# Altium schematic sheet 02_Power.SchDoc: OpenCamera Slider - Power
size A4; SheetNumber: 2; SheetTotal: 4; sk_ProjectName: WInFiDEL Sensor; sk_Title: Power and USB Connector
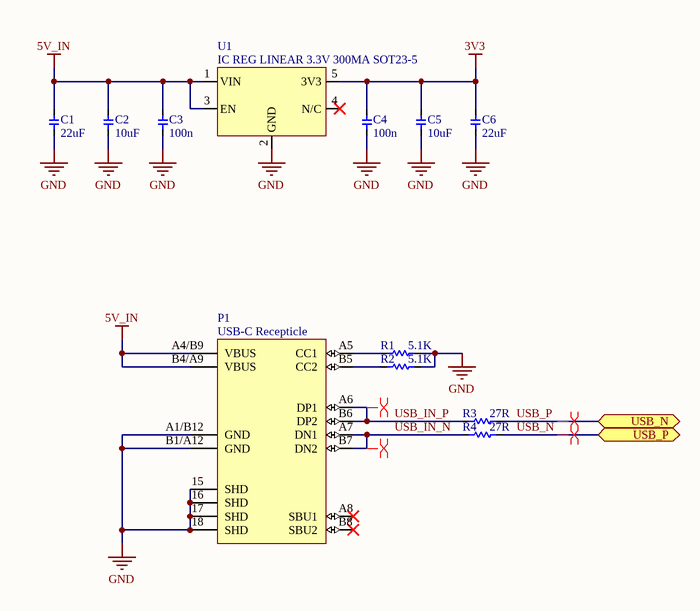
[diagram p0: 02_Power.SchDoc]

## Parts
C1  value 22uF  [0805]  (hidden comment: Cap)
C2  value 10uF  [0603 - CAP]  (hidden comment: Cap)
C3  value 100n  [0603 - CAP]  (hidden comment: Cap)
C4  value 100n  [0603 - CAP]  (hidden comment: Cap)
C5  value 10uF  [0603 - CAP]  (hidden comment: Cap)
C6  value 22uF  [0805]  (hidden comment: Cap)
P1  USB-C Recepticle  [GCT_USB4105-GF-A]
R1  value 5.1K  [0603]  (hidden comment: Res)
R2  value 5.1K  [0603]  (hidden comment: Res)
R3  value 27R  [0603]  (hidden comment: Res)
R4  value 27R  [0603]  (hidden comment: Res)
U1  IC REG LINEAR 3.3V 300MA SOT23-5  [SOT-23-5]

## Ports
USB_N (bidir), USB_P (bidir)

## Nets
3V3: C4.2 C5.2 C6.2 U1.5(3V3)
5V_IN: C1.2 C2.2 C3.2 P1.A4/B9(VBUS) P1.B4/A9(VBUS) U1.1(VIN) U1.3(EN)
GND: C1.1 C2.1 C3.1 C4.1 C5.1 C6.1 P1.15(SHD) P1.16(SHD) P1.17(SHD) P1.18(SHD) P1.A1/B12(GND) P1.B1/A12(GND) R1.2 R2.2 U1.2(GND)
USB_IN_N: P1.A7(DN1) P1.B7(DN2) R4.1
USB_IN_P: P1.A6(DP1) P1.B6(DP2) R3.1
USB_N: R4.2 ; port USB_P
USB_P: R3.2 ; port USB_N
NetP1_A5: P1.A5(CC1) R1.1
NetP1_B5: P1.B5(CC2) R2.1

Not connected (* = marked no-connect by the designer): P1 A8(SBU1)* B8(SBU2)*; U1 4(N/C)*

## Layout directives
differential pair: USB_IN_N, USB_IN_P, USB_N, USB_P

## Notes on the sheet
- Page
- Title
- www.SasaKaranovic.com <http://www.SasaKaranovic.com>
- of

## Library data of the parts
C1 C6 = Cap: Capacitor; Manufacturer: Samsung Electro-Mechanics; Manufacturer Part Number: CL21A226MAYNNNE; Voltage: 25V; Distributor Part Number: C602037; Distributor: LCSC
C2 C5 = Cap: Capacitor; Manufacturer: Samsung Electro-Mechanics; Manufacturer Part Number: CL21A106KAYNNNE; Voltage: 25V; Distributor Part Number: C15850; Distributor: LCSC
C3 C4 = Cap: Capacitor; Manufacturer: Samsung Electro-Mechanics; Manufacturer Part Number: CL10B104KB8NNNC; Voltage: 50V; Temp Rating: X7R; Distributor Part Number: C1591; Distributor: LCSC
P1 = USB-C Recepticle -USB-TYPE-C-019: 3A 1 Surface Mount 16P Female -25℃~+85℃ Type-C SMD USB Connectors ROHS; Manufacturer: DEALON; Manufacturer Part Number: USB-TYPE-C-019; Distributor Part Number: C2927039; Distributor: LCSC
R1 R2 = Res: Resistor; Manufacturer: YAGEO; Manufacturer Part Number: RC0603FR-075K1L; Power Rating: 100mW; Tolerance: 1%; Distributor: LCSC; Distributor Part Number: C105580
R3 R4 = Res: Resistor; Manufacturer: YAGEO; Manufacturer Part Number: RC0603FR-0727RL; Power Rating: 100mW; Tolerance: 1%; Distributor: LCSC; Distributor Part Number: C137753
U1 = AP7366-33W5-7: 600mA null 3.3V positive 6V SOT-25 Linear Voltage Regulators (LDO) ROHS; Manufacturer: Diodes Incorporated; Distributor: LCSC; Distributor Part Number: C526385; Manufacturer Part Number: AP7366-33W5-7